# EAGLE schematic TriggerTrap (EAGLE 6.5.0)
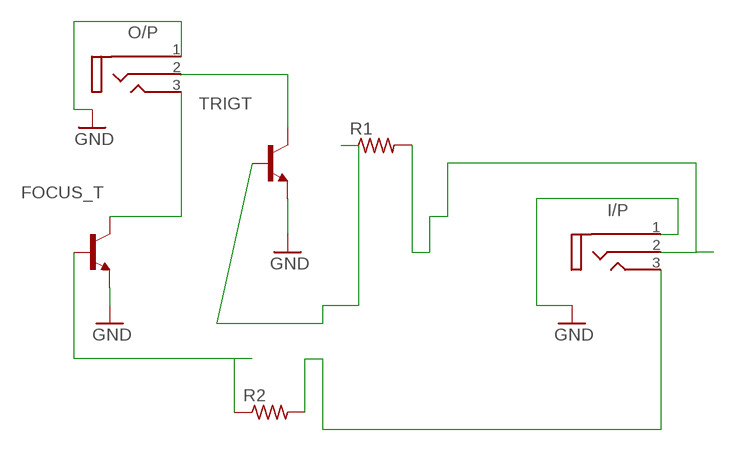
[diagram p0: schematic, sheet 1]

## Parts
FOCUS_T  BC547  [TO92]
I/P  CON-3.5MM-STEREO-SMT  [CON-3.5MM-STEREO-SMT]
O/P  CON-3.5MM-STEREO-SMT  [CON-3.5MM-STEREO-SMT]
R1  R-US_FLIPFLOP7  [0805-THM-7]
R2  R-US_FLIPFLOP7  [0805-THM-7]
TRIGT  BC547  [TO92]

## Nets
GND: FOCUS_T.1(E) I/P.1 O/P.1 TRIGT.1(E)
N$1: FOCUS_T.2(B) R2.1
N$2: R1.1 TRIGT.2(B)
N$3: O/P.2 TRIGT.3(C)
N$4: FOCUS_T.3(C) O/P.3
N$5: I/P.3 R2.2
N$6: I/P.2 R1.2

## Library data of the parts
FOCUS_T TRIGT = transistor:BC547: NPN TRANSISTOR
I/P O/P = con-3.5mm-stereo-smt:CON-3.5MM-STEREO-SMT
R1 R2 = adafruit:R-US_: RESISTOR, American symbol